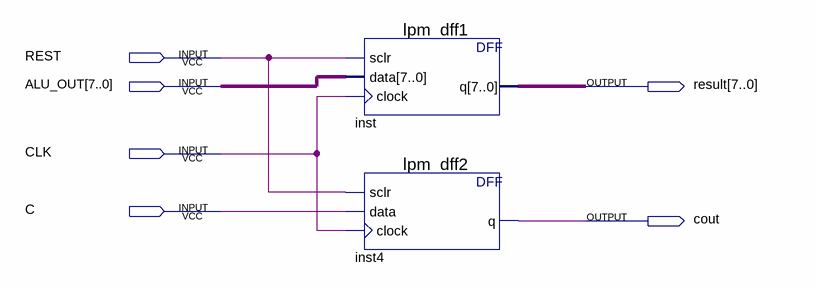
[diagram p0: schematic sheet]
// Quartus schematic DR.bdf as structural Verilog: 2 symbols, 6 pins
module DR (
  input  REST,
  input  [7:0] ALU_OUT,
  input  CLK,
  input  C,
  output [7:0] result,
  output cout
);

  lpm_dff1 inst (.sclr(REST), .data(ALU_OUT), .clock(CLK), .q(result));
  lpm_dff2 inst4 (.sclr(REST), .data(C), .clock(CLK), .q(cout));
endmodule
